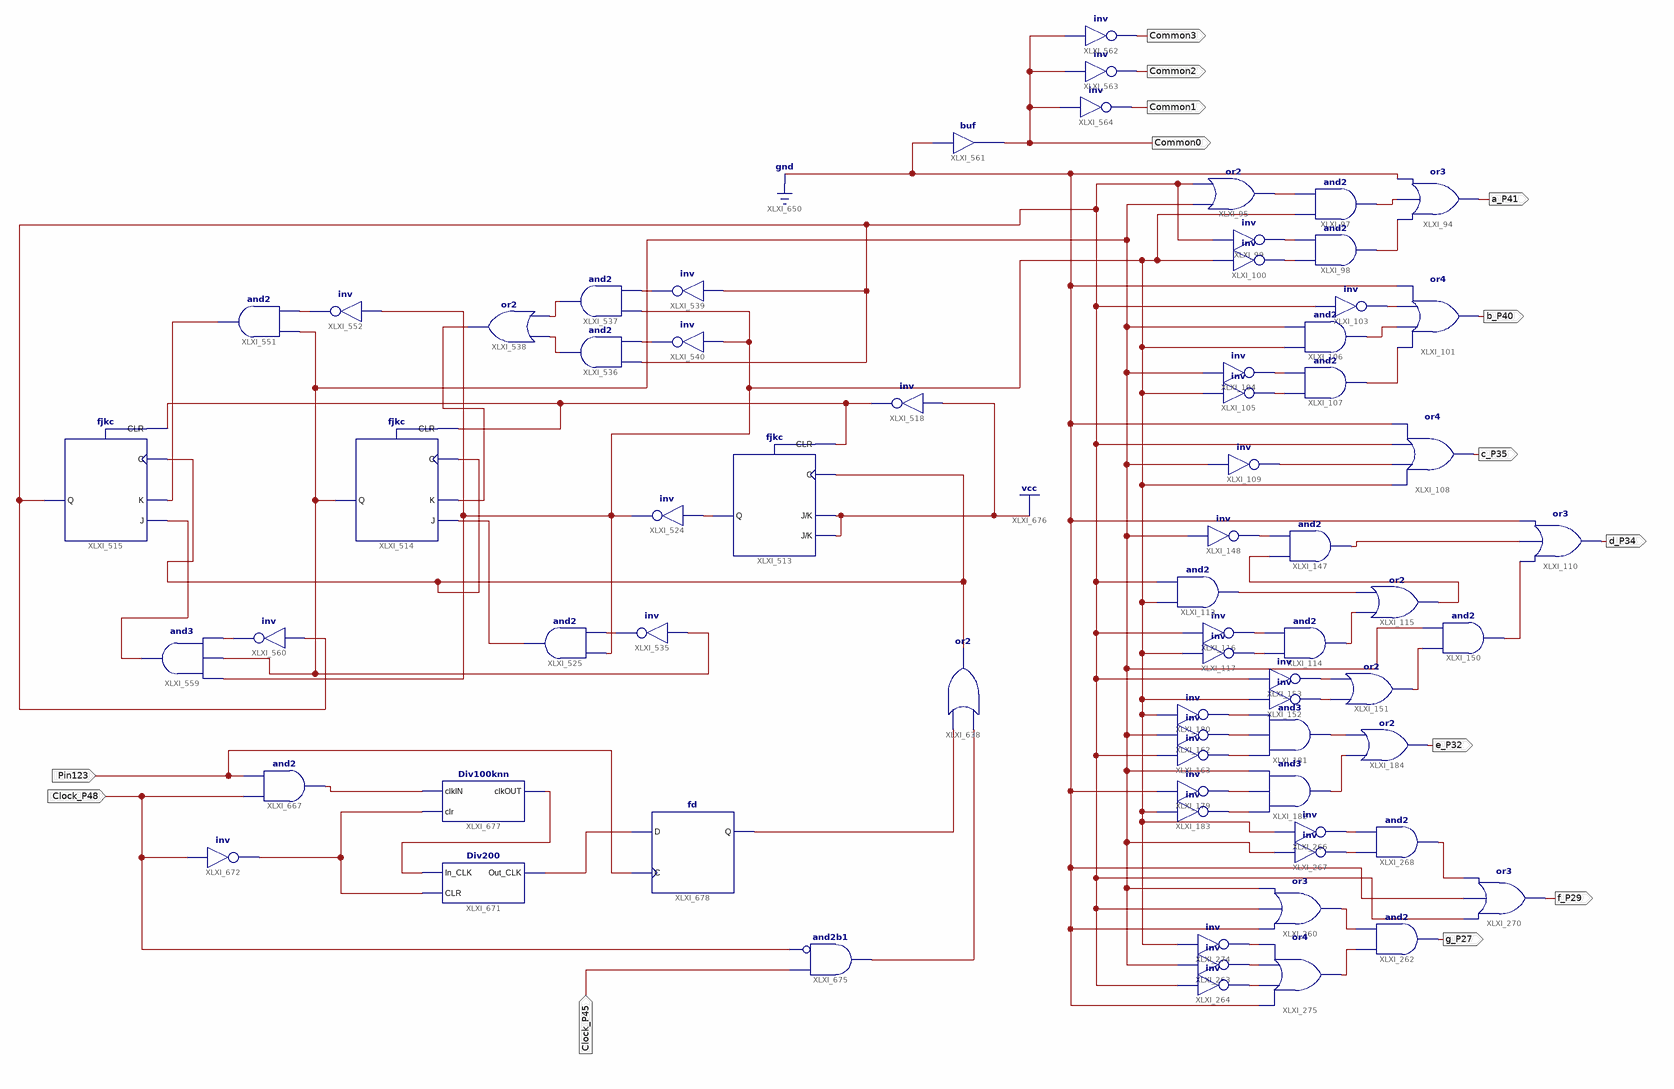
[diagram p0: schematic sheet 1]
// Xilinx ISE schematic Lab05_no2.sch (spartan6) as structural Verilog: 71 symbols, 14 ports
module Lab05_no2 (
  input  Clock_P45,
  input  Clock_P48,
  input  Pin123,
  output a_P41,
  output b_P40,
  output c_P35,
  output e_P32,
  output d_P34,
  output g_P27,
  output f_P29,
  output Common0,
  output Common2,
  output Common3,
  output Common1
);

  wire A_P58, B_P57, C_P56, XLXN_234, XLXN_238, XLXN_241, XLXN_242, XLXN_243, XLXN_249, XLXN_250, XLXN_251,
       XLXN_253, XLXN_254, XLXN_263, XLXN_277, XLXN_278, XLXN_279, XLXN_293, XLXN_320, XLXN_322, XLXN_323,
       XLXN_328, XLXN_329, XLXN_330, XLXN_333, XLXN_380, XLXN_381, XLXN_382, XLXN_383, XLXN_384, XLXN_386,
       XLXN_387, XLXN_513, XLXN_514, XLXN_519, XLXN_520, XLXN_532, XLXN_533, XLXN_536, XLXN_545, XLXN_879,
       XLXN_888, XLXN_891, XLXN_892, XLXN_893, XLXN_895, XLXN_896, XLXN_907, XLXN_910, XLXN_912, XLXN_920,
       XLXN_921, XLXN_1032, XLXN_1060, XLXN_1063, XLXN_1064, XLXN_1069, XLXN_1083, XLXN_1085, XLXN_1086;

  or XLXI_94 (a_P41, XLXN_241, XLXN_234, 1'b0);
  or XLXI_95 (XLXN_238, B_P57, C_P56);
  and XLXI_97 (XLXN_234, A_P58, XLXN_238);
  and XLXI_98 (XLXN_241, XLXN_243, XLXN_242);
  not XLXI_99 (XLXN_242, C_P56);
  not XLXI_100 (XLXN_243, A_P58);
  or XLXI_101 (b_P40, XLXN_251, XLXN_250, XLXN_249, 1'b0);
  not XLXI_103 (XLXN_249, C_P56);
  and XLXI_106 (XLXN_250, A_P58, B_P57);
  and XLXI_107 (XLXN_251, XLXN_253, XLXN_254);
  not XLXI_105 (XLXN_253, A_P58);
  not XLXI_104 (XLXN_254, B_P57);
  not XLXI_109 (XLXN_263, B_P57);
  or XLXI_108 (c_P35, A_P58, XLXN_263, C_P56, 1'b0);
  or XLXI_115 (XLXN_322, XLXN_293, XLXN_277);
  not XLXI_116 (XLXN_278, C_P56);
  and XLXI_114 (XLXN_293, XLXN_279, XLXN_278);
  and XLXI_113 (XLXN_277, A_P58, C_P56);
  and XLXI_147 (XLXN_323, XLXN_322, XLXN_320);
  not XLXI_148 (XLXN_320, B_P57);
  or XLXI_110 (d_P34, XLXN_333, XLXN_323, 1'b0);
  and XLXI_150 (XLXN_333, XLXN_330, B_P57);
  or XLXI_151 (XLXN_330, XLXN_328, XLXN_329);
  not XLXI_117 (XLXN_279, A_P58);
  not XLXI_153 (XLXN_329, C_P56);
  not XLXI_152 (XLXN_328, A_P58);
  not XLXI_180 (XLXN_382, A_P58);
  not XLXI_162 (XLXN_381, B_P57);
  not XLXI_163 (XLXN_380, C_P56);
  and XLXI_181 (XLXN_386, XLXN_380, XLXN_381, XLXN_382);
  or XLXI_184 (e_P32, XLXN_387, XLXN_386);
  not XLXI_183 (XLXN_384, A_P58);
  not XLXI_179 (XLXN_383, 1'b0);
  or XLXI_260 (XLXN_513, 1'b0, C_P56, B_P57);
  and XLXI_262 (g_P27, XLXN_514, XLXN_513);
  not XLXI_263 (XLXN_519, B_P57);
  not XLXI_264 (XLXN_520, C_P56);
  and XLXI_268 (XLXN_536, XLXN_532, XLXN_533);
  and XLXI_182 (XLXN_387, XLXN_384, XLXN_383, B_P57);
  not XLXI_267 (XLXN_532, B_P57);
  not XLXI_266 (XLXN_533, A_P58);
  or XLXI_270 (f_P29, C_P56, 1'b0, XLXN_536);
  not XLXI_274 (XLXN_545, A_P58);
  or XLXI_275 (XLXN_514, 1'b0, XLXN_520, XLXN_519, XLXN_545);
  not XLXI_518 (XLXN_1032, 1'b1);
  fjkc XLXI_513 (.C(XLXN_1060), .CLR(XLXN_1032), .J(1'b1), .K(1'b1), .Q(XLXN_879));
  not XLXI_524 (A_P58, XLXN_879);
  and XLXI_525 (XLXN_891, XLXN_888, A_P58);
  fjkc XLXI_514 (.C(XLXN_1060), .CLR(XLXN_1032), .J(XLXN_891), .K(XLXN_907), .Q(B_P57));
  fjkc XLXI_515 (.C(XLXN_1060), .CLR(XLXN_1032), .J(XLXN_920), .K(XLXN_912), .Q(C_P56));
  not XLXI_535 (XLXN_888, B_P57);
  or XLXI_538 (XLXN_907, XLXN_893, XLXN_892);
  and XLXI_536 (XLXN_892, XLXN_896, C_P56);
  and XLXI_537 (XLXN_893, XLXN_895, A_P58);
  not XLXI_539 (XLXN_895, C_P56);
  not XLXI_540 (XLXN_896, A_P58);
  not XLXI_552 (XLXN_910, A_P58);
  and XLXI_551 (XLXN_912, XLXN_910, B_P57);
  and XLXI_559 (XLXN_920, XLXN_921, B_P57, A_P58);
  not XLXI_560 (XLXN_921, C_P56);
  buf XLXI_561 (Common0, 1'b0);
  not XLXI_562 (Common3, Common0);
  not XLXI_563 (Common2, Common0);
  not XLXI_564 (Common1, Common0);
  or XLXI_638 (XLXN_1060, XLXN_1083, XLXN_1086);
  and XLXI_667 (XLXN_1063, Clock_P48, Pin123);
  Div200 XLXI_671 (.In_CLK(XLXN_1064), .CLR(XLXN_1069), .Out_CLK(XLXN_1085));
  not XLXI_672 (XLXN_1069, Clock_P48);
  and XLXI_675 (XLXN_1083, ~Clock_P48, Clock_P45);  // and2b1
  Div100knn XLXI_677 (.clkIN(XLXN_1063), .clr(XLXN_1069), .clkOUT(XLXN_1064));
  fd XLXI_678 (.C(Pin123), .D(XLXN_1085), .Q(XLXN_1086));
endmodule
